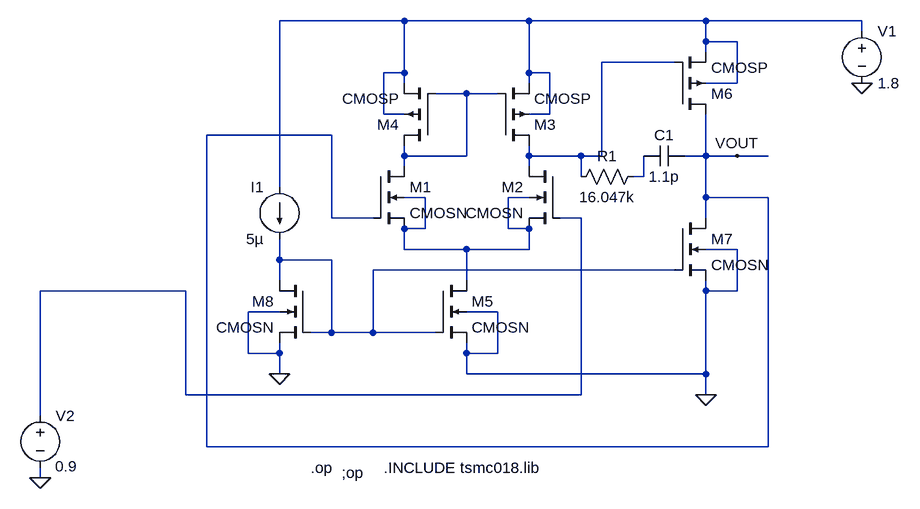
[diagram p0: schematic 2-stageOpamp.asc]
2-stageOpamp.asc, the LTspice schematic file:
Version 4
SHEET 1 880 680
WIRE -1024 -528 -1216 -528
WIRE -832 -528 -1024 -528
WIRE -560 -528 -832 -528
WIRE -320 -528 -560 -528
WIRE -320 -512 -320 -528
WIRE -560 -496 -560 -528
WIRE -512 -496 -560 -496
WIRE -560 -480 -560 -496
WIRE -608 -464 -720 -464
WIRE -1024 -448 -1024 -528
WIRE -1024 -448 -1056 -448
WIRE -832 -448 -832 -528
WIRE -800 -448 -832 -448
WIRE -1024 -432 -1024 -448
WIRE -832 -432 -832 -448
WIRE -512 -432 -512 -496
WIRE -512 -432 -560 -432
WIRE -928 -416 -976 -416
WIRE -880 -416 -928 -416
WIRE -1056 -384 -1056 -448
WIRE -1024 -384 -1056 -384
WIRE -800 -384 -800 -448
WIRE -800 -384 -832 -384
WIRE -1136 -352 -1328 -352
WIRE -1024 -320 -1024 -336
WIRE -928 -320 -928 -416
WIRE -928 -320 -1024 -320
WIRE -832 -320 -832 -336
WIRE -752 -320 -832 -320
WIRE -720 -320 -720 -464
WIRE -720 -320 -752 -320
WIRE -560 -320 -560 -384
WIRE -560 -320 -592 -320
WIRE -512 -320 -560 -320
WIRE -464 -320 -512 -320
WIRE -1024 -304 -1024 -320
WIRE -832 -304 -832 -320
WIRE -752 -288 -752 -320
WIRE -656 -288 -656 -320
WIRE -656 -288 -672 -288
WIRE -1216 -272 -1216 -528
WIRE -992 -256 -1024 -256
WIRE -832 -256 -864 -256
WIRE -560 -256 -560 -320
WIRE -464 -256 -560 -256
WIRE -1136 -224 -1136 -352
WIRE -1072 -224 -1136 -224
WIRE -752 -224 -784 -224
WIRE -560 -224 -560 -256
WIRE -992 -208 -992 -256
WIRE -992 -208 -1024 -208
WIRE -864 -208 -864 -256
WIRE -832 -208 -864 -208
WIRE -1024 -176 -1024 -208
WIRE -928 -176 -1024 -176
WIRE -832 -176 -832 -208
WIRE -832 -176 -928 -176
WIRE -512 -176 -560 -176
WIRE -1216 -160 -1216 -192
WIRE -1136 -160 -1216 -160
WIRE -608 -144 -1072 -144
WIRE -1216 -128 -1216 -160
WIRE -928 -128 -928 -176
WIRE -1360 -112 -1584 -112
WIRE -560 -112 -560 -128
WIRE -512 -112 -512 -176
WIRE -512 -112 -560 -112
WIRE -1216 -80 -1264 -80
WIRE -880 -80 -928 -80
WIRE -1136 -48 -1136 -160
WIRE -1136 -48 -1168 -48
WIRE -1072 -48 -1072 -144
WIRE -1072 -48 -1136 -48
WIRE -976 -48 -1072 -48
WIRE -1264 -16 -1264 -80
WIRE -1216 -16 -1216 -32
WIRE -1216 -16 -1264 -16
WIRE -928 -16 -928 -32
WIRE -880 -16 -880 -80
WIRE -880 -16 -928 -16
WIRE -1216 16 -1216 -16
WIRE -928 16 -928 -16
WIRE -560 16 -560 -112
WIRE -560 16 -928 16
WIRE -1360 48 -1360 -112
WIRE -752 48 -752 -224
WIRE -752 48 -1360 48
WIRE -560 48 -560 16
WIRE -1584 80 -1584 -112
WIRE -1328 128 -1328 -352
WIRE -464 128 -464 -256
WIRE -464 128 -1328 128
WIRE -1584 176 -1584 160
FLAG -560 48 0
FLAG -1216 16 0
FLAG -320 -432 0
FLAG -1584 176 0
FLAG -512 -320 VOUT
SYMBOL cmosn -1072 -304 R0
SYMATTR InstName M1
SYMATTR Value2 l=0.36u w=0.373824u
SYMBOL cmosn -784 -304 M0
SYMATTR InstName M2
SYMATTR Value2 l=0.36u w=0.373824u
SYMBOL cmosn -976 -128 R0
SYMATTR InstName M5
SYMATTR Value2 l=0.36u w=0.39132u
SYMBOL cmosp -976 -336 R180
SYMATTR InstName M4
SYMATTR Value2 l=0.36u w=0.45u
SYMBOL cmosp -880 -336 M180
SYMATTR InstName M3
SYMATTR Value2 l=0.36u w=0.45u
SYMBOL cap -592 -336 R90
WINDOW 0 0 32 VBottom 2
WINDOW 3 32 32 VTop 2
SYMATTR InstName C1
SYMATTR Value 1.1p
SYMBOL cmosp -608 -384 M180
SYMATTR InstName M6
SYMATTR Value2 l=0.36u w=6.22u
SYMBOL cmosn -608 -224 R0
SYMATTR InstName M7
SYMATTR Value2 l=0.36u w=2.7036u
SYMBOL cmosn -1168 -128 M0
SYMATTR InstName M8
SYMATTR Value2 l=0.36u w=0.39132u
SYMBOL current -1216 -272 M0
WINDOW 123 0 0 Left 2
WINDOW 39 0 0 Left 2
SYMATTR InstName I1
SYMATTR Value 5µ
SYMBOL voltage -320 -528 R0
WINDOW 123 0 0 Left 2
WINDOW 39 0 0 Left 2
SYMATTR InstName V1
SYMATTR Value 1.8
SYMBOL voltage -1584 64 R0
WINDOW 123 24 124 Left 2
WINDOW 39 0 0 Left 2
WINDOW 3 23 94 Left 2
SYMATTR Value 0.9
SYMATTR InstName V2
SYMBOL res -656 -304 R90
WINDOW 0 0 56 VBottom 2
WINDOW 3 32 56 VTop 2
SYMATTR InstName R1
SYMATTR Value 16.047k
TEXT -1056 160 Left 2 !.INCLUDE tsmc018.lib
TEXT -1120 168 Left 2 !;op
TEXT -1168 160 Left 2 !.op

The netlist it stands for:
* 2-stageOpamp.asc
M1 N003 VOUT N005 N005 CMOSN l=0.36u w=0.373824u
M2 N002 N006 N005 N005 CMOSN l=0.36u w=0.373824u
M5 N005 N007 0 0 CMOSN l=0.36u w=0.39132u
M4 N003 N003 N001 N001 CMOSP l=0.36u w=0.45u
M3 N002 N003 N001 N001 CMOSP l=0.36u w=0.45u
C1 VOUT N004 1.1p
M6 VOUT N002 N001 N001 CMOSP l=0.36u w=6.22u
M7 VOUT N007 0 0 CMOSN l=0.36u w=2.7036u
M8 N007 N007 0 0 CMOSN l=0.36u w=0.39132u
I1 N001 N007 5µ
V1 N001 0 1.8
V2 N006 0 0.9
R1 N004 N002 16.047k
.model NMOS NMOS
.model PMOS PMOS
.lib standard.mos
.INCLUDE tsmc018.lib
;op
.op
.backanno
.end